# Altium schematic sheet Activity_Recognition_Board_v1.0_Power.SchDoc
size A4
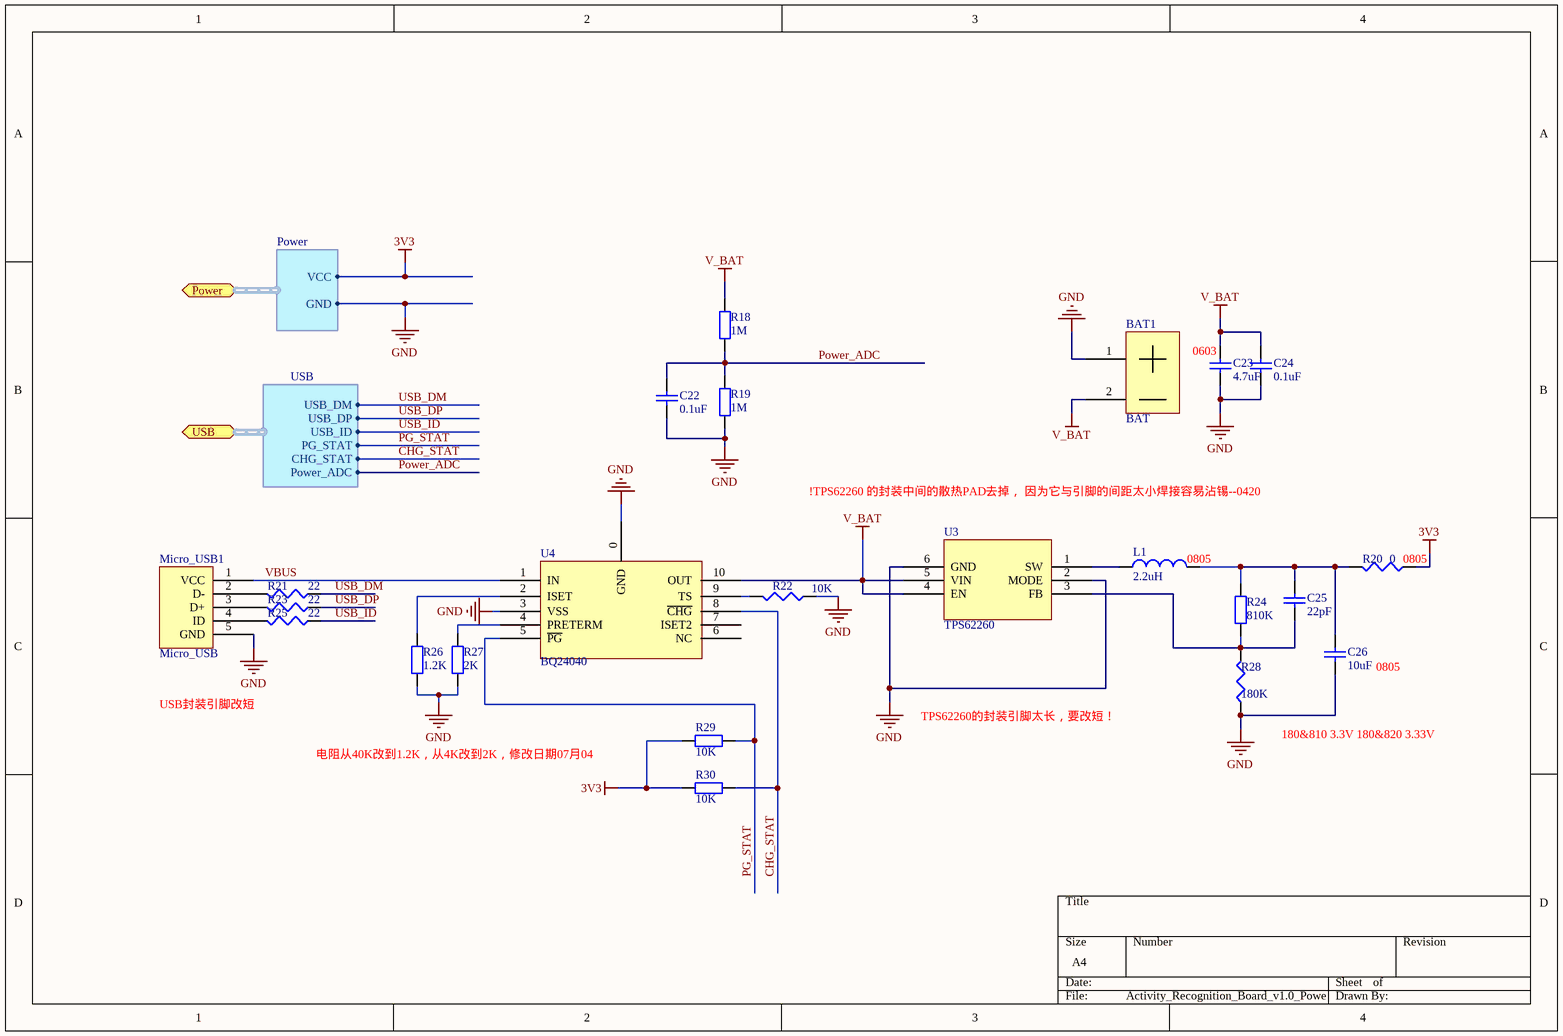
[diagram p0: Activity_Recognition_Board_v1.0_Power.SchDoc]

## Parts
BAT1  BAT  [BHDR2_1.87]
C22  value 0.1uF  [C0402]  (hidden comment: Cap semi)
C23  value 4.7uF  [C0603]  (hidden comment: Cap semi)
C24  value 0.1uF  [C0402]  (hidden comment: Cap semi)
C25  value 22pF  [C0402]  (hidden comment: Cap semi)
C26  value 10uF  [C0805]  (hidden comment: Cap semi)
L1  value 2.2uH  [L0805]  (hidden comment: Inductor)
Micro_USB1  Micro_USB  [Micro_USB]
R18  value 1M  [R0402]  (hidden comment: Res2)
R19  value 1M  [R0402]  (hidden comment: Res2)
R20  value 0  [R0805]  (hidden comment: Res3)
R21  value 22  [R0402]  (hidden comment: Res3)
R22  value 10K  [R0402]  (hidden comment: Res3)
R23  value 22  [R0402]  (hidden comment: Res3)
R24  value 810K  [R0402]  (hidden comment: Res2)
R25  value 22  [R0402]  (hidden comment: Res3)
R26  value 1.2K  [R0402]  (hidden comment: Res2)
R27  value 2K  [R0402]  (hidden comment: Res2)
R28  value 180K  [R0402]  (hidden comment: Res3)
R29  value 10K  [R0402]  (hidden comment: Res2)
R30  value 10K  [R0402]  (hidden comment: Res2)
U3  TPS62260  [QFN-6]
U4  BQ24040  [WSON10]

## Ports
Power (harness Power), USB (harness USB)

## Harnesses
Power: VCC, GND
USB: USB_DM, USB_DP, USB_ID, PG_STAT, CHG_STAT, Power_ADC

## Nets
3V3: R20.1 R29.1 R30.1 ; port Power.VCC
GND: BAT1.1(+) C22.1 C23.1 C24.1 C26.1 Micro_USB1.5(GND) R19.2 R22.1 R26.1 R27.1 R28.1 U3.2(MODE) U3.6(GND) U4.0(GND) U4.3(VSS) ; port Power.GND
V_BAT: BAT1.2(-) C23.2 C24.2 R18.1 U3.4(EN) U3.5(VIN) U4.10(OUT)
CHG_STAT: R30.2 U4.8(~{CHG}) ; port USB.CHG_STAT
PG_STAT: R29.2 U4.5(~{PG}) ; port USB.PG_STAT
Power_ADC: C22.2 R18.2 R19.1 ; port USB.Power_ADC
USB_DM: R21.1 ; port USB.USB_DM
USB_DP: R23.1 ; port USB.USB_DP
USB_ID: R25.1 ; port USB.USB_ID
VBUS: Micro_USB1.1(VCC) U4.1(IN)
NetC25_1: C25.1 R24.1 R28.2 U3.3(FB)
NetC25_2: C25.2 C26.2 L1.2 R20.2 R24.2
NetL1_1: L1.1 U3.1(SW)
NetMicro_USB1_2: Micro_USB1.2(D-) R21.2
NetMicro_USB1_3: Micro_USB1.3(D+) R23.2
NetMicro_USB1_4: Micro_USB1.4(ID) R25.2
NetR22_2: R22.2 U4.9(TS)
NetR26_2: R26.2 U4.2(ISET)
NetR27_2: R27.2 U4.4(PRETERM)

Not connected (* = marked no-connect by the designer): U4 6(NC) 7(ISET2)

## Notes on the sheet
- (near C23) 0603
- !TPS62260 的封装中间的散热PAD去掉， 因为它与引脚的间距太小焊接容易沾锡--0420
- (near L1) 0805
- (near R20) 0805
- (near C26) 0805
- 180&810 3.3V 180&820 3.33V
- Labels drawn without touching a wire or pin: TPS62260的封装引脚太长，要改短！, USB封装引脚改短, 电阻从40K改到1.2K，从4K改到2K，修改日期07月04

## Library data of the parts
BAT1 = BAT_CN
C22-C26 = Cap semi: Capacitor (Semiconductor SIM Model); Published: 8-Jun-2000; LatestRevisionDate: 29-May-2009; LatestRevisionNote: IPC-7351 Footprint Added.; PackageReference: C1206; Publisher: Altium Limited; PackageDescription: Chip Capacitor
L1 = Inductor: Code_IEC: 1005; Published: 8-Jun-2000; LatestRevisionDate: 29-May-2009; LatestRevisionNote: IPC-7351 Footprint Added.; PackageReference: 0402-A; Publisher: Altium Limited; PackageDescription: Chip Inductor; Code_JEITA: 0402
Micro_USB1 = Micri_USB
R18 R19 R24 R26 R27 R29 R30 = Res2: Resistor; Published: 8-Jun-2000; LatestRevisionDate: 17-Jul-2002; LatestRevisionNote: Re-released for DXP Platform.; PackageReference: AXIAL-0.4; Publisher: Altium Limited
R20-R23 R25 R28 = Res3: Resistor; Published: 8-Jun-2000; LatestRevisionDate: 29-May-2009; LatestRevisionNote: IPC-7351 Footprint Added.; PackageReference: J1-0603; Publisher: Altium Limited; PackageDescription: Chip Resistor
U3 = TPS62260: DC-DC buck